# Altium project Buck_Converter.PrjPcb
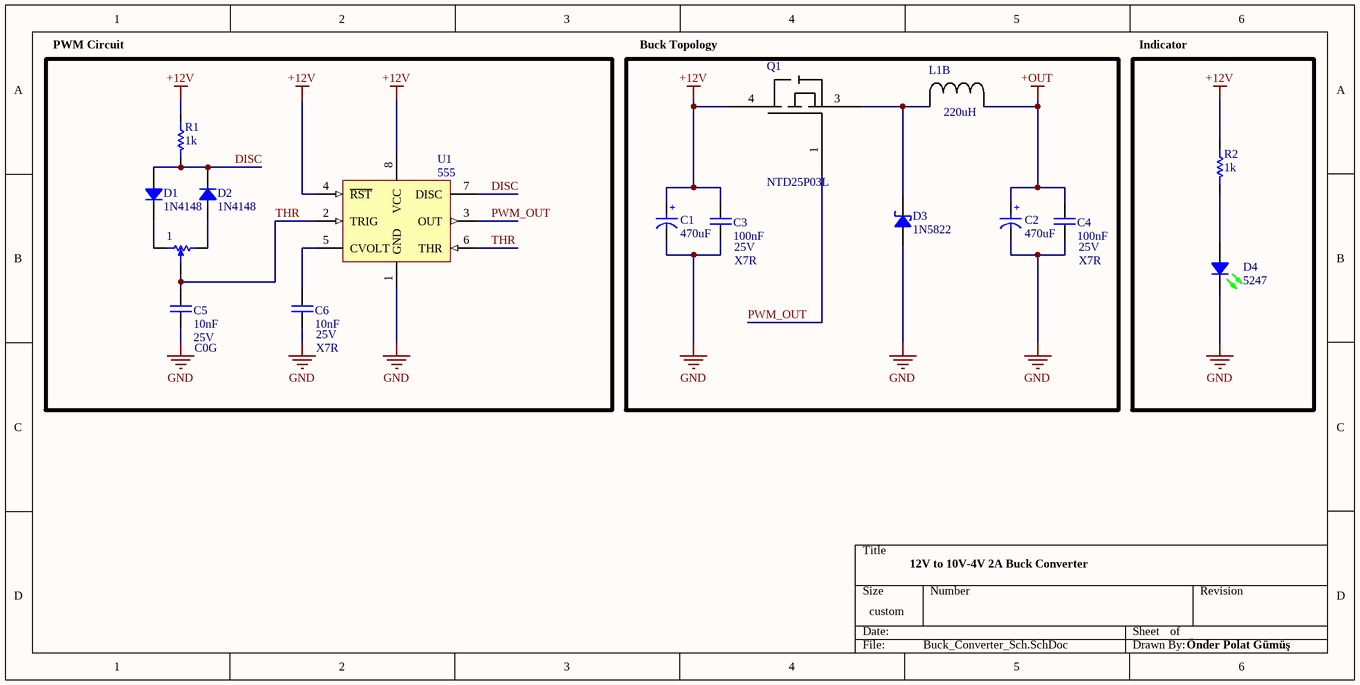
[diagram p0: Buck_Converter_Sch.SchDoc]
1 sheet, 16 parts. Net scope: global (net labels, ports and power ports of the same name join across sheets).
Board file: Buck_Converter_PCB.PcbDoc

## Sheet Buck_Converter_Sch.SchDoc
size 254 x 127 mm; SheetNumber: 1; SheetTotal: 1

### Parts
1  Value?  [POT4MM-Small Pot]  (value not drawn)
C1  Inflow: 470uF  [Cap 03]  (hidden comment: 470u'F, 25'V)
C2  Inflow: 470uF  [Cap 03]  (hidden comment: 470u'F, 25'V)
C3  Rating: 25V  [CAP 1206/3216]  (hidden comment: 100nF)
C4  Rating: 25V  [CAP 1206/3216]  (hidden comment: 100nF)
C5  Rating: 25V  [CAP 1206/3216]  (hidden comment: 10nF)
C6  Rating: 25V  [CAP 1206/3216]  (hidden comment: 10nF)
D1  1N4148  [DO-35]
D2  1N4148  [DO-35]
D3  1N5822  [BYW98]
D4  Inflow: 5247  [LED 1206/3216 GREEN]  (hidden comment: Green, 1206)
L1  220uH  [12x12x10mm_Inductor]  (part B of 2)
Q1  NTD25P03L  [TO229P990X238-3N]
R1  1k  [RES 1206 (3216X08L)]
R2  1k  [RES 1206 (3216X08L)]
U1  Inflow: 555  [SO8_narrow_m]  (hidden comment: NE555)

### Blocks framed on the sheet
Indicator: D4 R2

### Nets
+12V: C1.1(+) C3.1 Q1.4 R1.1 R2.1 U1.4(~{RST}) U1.8(VCC)
+OUT: C2.1(+) C4.1 L1.1
GND: C1.2(-) C2.2(-) C3.2 C4.2 C5.2 C6.2 D3.1 D4.2 U1.1(GND)
DISC: D1.1 D2.2 R1.2 U1.7(DISC)
PWM_OUT: Q1.1 U1.3(OUT)
THR: 1.W C5.1 U1.2(TRIG) U1.6(THR)
Net1_CCW: 1.CCW(-) D2.1
Net1_CW: 1.CW(+) D1.2
NetC6_1: C6.1 U1.5(CVOLT)
NetD3_2: D3.2 L1.0 Q1.3
NetD4_1: D4.1 R2.2

### Notes on the sheet
- PWM Circuit
- Buck Topology
- (near C3) X7R
- (near C4) X7R
- (near C5) C0G
- (near C6) X7R
- 12V to 10V-4V 2A Buck Converter
- Önder Polat Gümüş

### Library data of the parts
1 = Res_Pot_SM: Square Trimming Potentiometer; Rating: Rating?; Validation: NT; Inflow: inflow?; Package: Package?; Type: Type?; Value: Value?
C1 C2 = Cap_Elec_470u_25: Electrolit Capacitor; Rating: Rating?; Type: Type?; Validation: NT; Value: 470u'F, 25'V; Package: Package?
C3-C6 = Cap_Multi_SMD: Bipolar ceramic capacitor SMD; Inflow: inflow?; Type: Type?; Validation: Valid; Package: Package?
  C3 C4: Value: 100nF
  C5 C6: Value: 10nF
D1 D2 = Semi_Diod_STD_1N4148: High Conductance Fast Diode; Rating: Rating?; Type: Type?; Validation: NT; Value: 1N4148; Package: Package?; Inflow: 1N4148
D3 = Semi_Diod_Sch_1N5822: Schottky Rectifiers; Rating: Rating?; Type: Type?; Validation: NT; Value: 1N5822; Package: Package?; Inflow: 1N5822
D4 = Semi_LED_Green_1206: LED; Rating: Rating?; Type: Type?; Validation: Valid; Value: Green, 1206; Package: Package?
L1 = 12x12x10mm Inductor
R1 R2 = Res_SMD: Resistor; Inflow: inflow?; Rating: Rating?; Validation: Valid; Package: Package?; Type: 10%; Value: 1k
U1 = IC_Timer_NE555_SMD: Astable or monostable operation timer; Rating: Rating?; Validation: Valid; Value: NE555; Package: Package?; Type: Type?